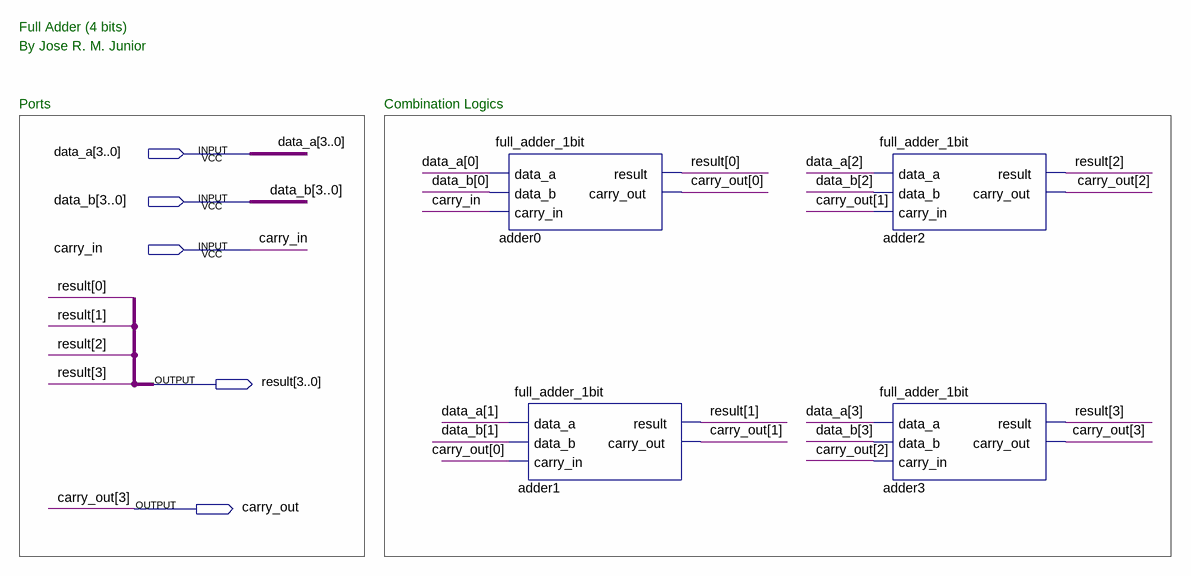
[diagram p0: schematic sheet]
// Quartus schematic full_adder_4bits.bdf as structural Verilog: 4 symbols, 5 pins
module full_adder_4bits (
  input  [3:0] data_a,
  input  [3:0] data_b,
  input  carry_in,
  output [3:0] result,
  output carry_out
);

  wire [2:0] carry_out_bus;

  full_adder_1bit adder0 (
    .data_a(data_a[0]), .data_b(data_b[0]), .carry_in(carry_in), .result(result[0]),
    .carry_out(carry_out_bus[0]));
  full_adder_1bit adder1 (
    .data_a(data_a[1]), .data_b(data_b[1]), .carry_in(carry_out_bus[0]), .result(result[1]),
    .carry_out(carry_out_bus[1]));
  full_adder_1bit adder2 (
    .data_a(data_a[2]), .data_b(data_b[2]), .carry_in(carry_out_bus[1]), .result(result[2]),
    .carry_out(carry_out_bus[2]));
  full_adder_1bit adder3 (
    .data_a(data_a[3]), .data_b(data_b[3]), .carry_in(carry_out_bus[2]), .result(result[3]),
    .carry_out(carry_out));

  // Other names for the same wires on the sheet: carry_out[3] = carry_out

  // Notes on the sheet:
  //   Full Adder (4 bits)
  //   By Jose R. M. Junior
  //   Ports
  //   Combination Logics
endmodule
